# Altium schematic sheet Thermometers.SchDoc: =ProjectName
size 420 x 297 mm; Author: T.P.; CompanyName: WUT; DrawnBy: T.P.; Organization: WUT ISE; Address1: Warsaw Univeristy of Technology; Address2: Nowowiejska 15/19; DocumentNumber: 22; Revision: 0.9; SheetNumber: 22; SheetTotal: 36; EDA_Number: ARTIQ; Projet: ARTIQ/SINARA; ModifiedBy: -; CreateDate: XX/XX/XXXX; CheckedDate: -; Title2: Thermometers.SchDoc; DivGrp: ISE; Designer: G.K. and T.P.; ModifiedDate: -; ProjectName: ADC/DAC MEZZANINE
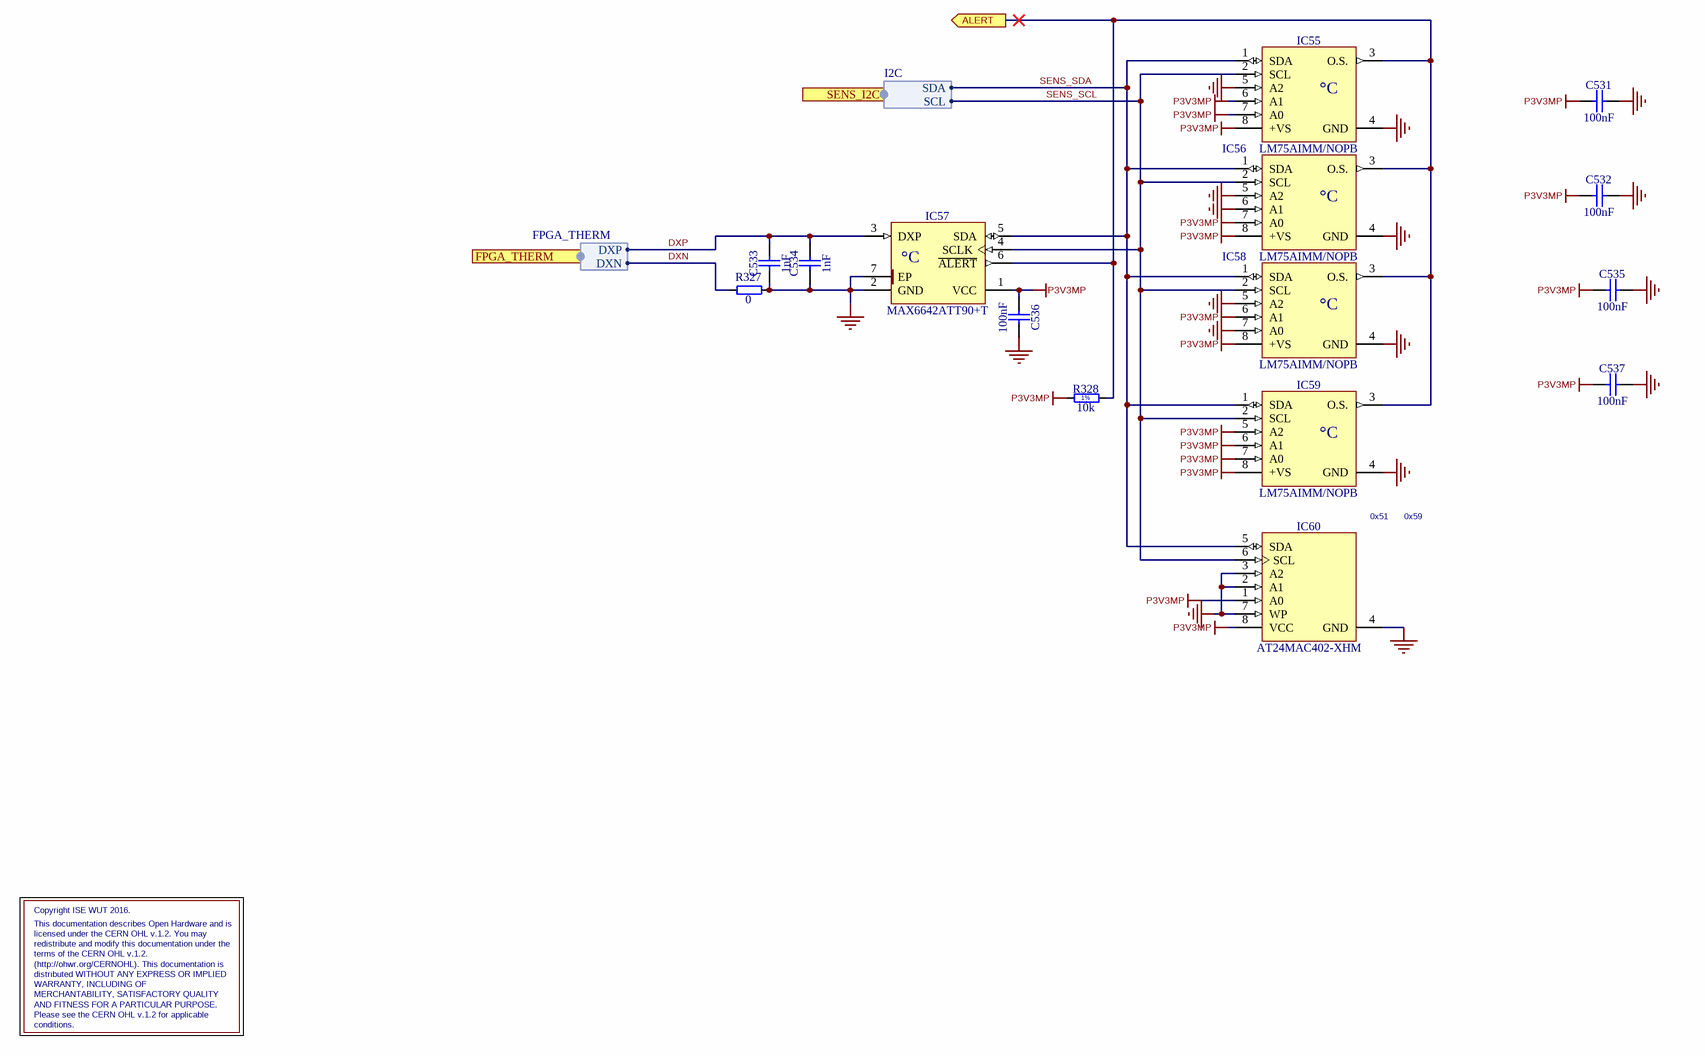
[diagram p0: Thermometers.SchDoc]

## Parts
C531  100nF  [CAPC0603X33N]
C532  100nF  [CAPC0603X33N]
C533  1nF  [CAPC1005X55N]
C534  1nF  [CAPC1005X55N]
C535  100nF  [CAPC0603X33N]
C536  100nF  [CAPC0603X33N]
C537  100nF  [CAPC0603X33N]
IC55  LM75AIMM/NOPB  [SOP65P490X109-8N]
IC56  LM75AIMM/NOPB  [SOP65P490X109-8N]
IC57  MAX6642ATT90+T  [SON95P300X300X80-7N-R160X240]
IC58  LM75AIMM/NOPB  [SOP65P490X109-8N]
IC59  LM75AIMM/NOPB  [SOP65P490X109-8N]
IC60  AT24MAC402-XHM  [SOP65P640X120-8N]
R327  0  [RESC1005X40N]
R328  10k  [RESC1005X40N]

## Ports
ALERT (out), FPGA_THERM (harness FPGA_THERM), SENS_I2C (harness I2C)

## Harnesses
FPGA_THERM: DXN, DXP
I2C: SCL, SDA

## Nets
GND: C531.2 C532.2 C533.1 C534.1 C535.2 C536.1 C537.2 IC55.4(GND) IC55.5(A2) IC56.4(GND) IC56.5(A2) IC56.6(A1) IC57.2(GND) IC57.7(EP) IC58.4(GND) IC58.5(A2) IC58.7(A0) IC59.4(GND) IC60.2(A1) IC60.3(A2) IC60.4(GND) IC60.7(WP) R327.2
P3V3MP: C531.1 C532.1 C535.1 C536.2 C537.1 IC55.6(A1) IC55.7(A0) IC55.8(+VS) IC56.7(A0) IC56.8(+VS) IC57.1(VCC) IC58.6(A1) IC58.8(+VS) IC59.5(A2) IC59.6(A1) IC59.7(A0) IC59.8(+VS) IC60.1(A0) IC60.8(VCC) R328.1
ALERT: IC55.3(O.S.) IC56.3(O.S.) IC57.6(~{ALERT}) IC58.3(O.S.) IC59.3(O.S.) R328.2 ; port ALERT
DXN: R327.1 ; port FPGA_THERM.DXN
DXP: C533.2 C534.2 IC57.3(DXP) ; port FPGA_THERM.DXP
SENS_SCL: IC55.2(SCL) IC56.2(SCL) IC57.4(SCLK) IC58.2(SCL) IC59.2(SCL) IC60.6(SCL) ; port SENS_I2C.SCL
SENS_SDA: IC55.1(SDA) IC56.1(SDA) IC57.5(SDA) IC58.1(SDA) IC59.1(SDA) IC60.5(SDA) ; port SENS_I2C.SDA

## Notes on the sheet
- 0x51
- 0x59
- Copyright ISE WUT 2016.
- licensed under the CERN OHL v.1.2. You may
- distributed WITHOUT ANY EXPRESS OR IMPLIED
- redistribute and modify this documentation under the
- (http://ohwr.org/CERNOHL). This documentation is
- This documentation describes Open Hardware and is
- terms of the CERN OHL v.1.2.
- WARRANTY, INCLUDING OF
- conditions.
- AND FITNESS FOR A PARTICULAR PURPOSE.
- Please see the CERN OHL v.1.2 for applicable
- MERCHANTABILITY, SATISFACTORY QUALITY
- Project/Equipment
- Document
- Designer
- Drawn by
- Check.by
- File
- Last Mod.
- Print Date
- Sheet
- Size
- A3
- of
- Rev
- (in symbol LM75AIMM/NOPB) °C
- (in symbol MAX6642ATT90+T) °C
- (in symbol R0402_10K_1%_0.0625W_100PPM) 1%

## Library data of the parts
C531 C532 C535-C537 = CC0201_100NF_6.3V_10%_X5R: Non-polarised capacitor; Manufacturer: GENERIC; Part Description: SMD Multilayer Chip Ceramic Capacitor; Manufacturer1 Part Number: 02016D104KAT2A; Tolerance: ±10%; Voltage: 6.3V; TC: X5R; Manufacturer Part Number: CC0201_100NF_6.3V_10%_X5R; Part Number: CC0201_100NF_6.3V_10%_X5R; Value: 100nF; Component Kind: Standard; Component Type: Standard; Pin Count: 2; Status: Not Recommended; Case: 0201; Mounted: Yes; Socket: No; SMD: Yes; Sense: No; Manufacturer1 Example: AVX; Manufacturer1 ComponentHeight: 0.33mm; HelpURL: \\cern.ch\dfs\Applications\Altium\Datasheets\CC0201_X5R_AVX.pdf; Author: CERN DEM JLC; CreateDate: 03.12.2007; LatestRevisionDate: 03.12.2007
C533 C534 = CC0402_1NF_50V_10%_X7R: Non-polarised capacitor; Manufacturer: GENERIC; Part Description: SMD Multilayer Chip Ceramic Capacitor; Manufacturer1 Part Number: 223858715623; Tolerance: ±10%; Voltage: 50V; TC: X7R; Manufacturer Part Number: CC0402_1NF_50V_10%_X7R; Part Number: CC0402_1NF_50V_10%_X7R; Value: 1nF; Component Kind: Standard; Component Type: Standard; Pin Count: 2; Status: Not Recommended; Case: 0402; Mounted: Yes; Socket: No; SMD: Yes; Sense: No; Manufacturer1 Example: PHYCOMP; Manufacturer1 ComponentHeight: 0.55mm; HelpURL: \\cern.ch\dfs\Applications\Altium\Datasheets\CC0402_X7R_PHYCOMP.pdf; Author: CERN DEM JLC; CreateDate: 03.12.2007; LatestRevisionDate: 03.12.2007
IC55 IC56 IC58 IC59 = LM75AIMM/NOPB: Digital Temperature Sensor and Thermal Watchdog with Two-Wire Interface; Manufacturer: TEXAS INSTRUMENTS; Part Description: -25° to +100°C ±2°C Digital Temperature Sensor and Thermal Watchdog with Two-Wire Interface; PressFit: No; Bonding: No; Manufacturer Part Number: LM75AIMM/NOPB; PackageDescription: SOP, 0.65mm pitch; 8 pin,3.00mm W X 3.00mm L X 1.09mm H bodyI, PC Medium Density; Part Number: LM75AIMM/NOPB; Component Kind: Standard; Component Type: Standard; Device: LM75AIMM/NOPB; Pin Count: 8; Case: SSOP8; Mounted: Yes; Socket: No; SMD: Yes; Sense: No; ComponentHeight: 1.09mm; HelpURL: \\cern.ch\dfs\Applications\Altium\Datasheets\LM75AIMM-NOPB.pdf; Author: CERN DEM JLC; CreateDate: 15.10.2012; LatestRevisionDate: 15.10.2012
IC57 = MAX6642ATT90+T: ±1°C, SMBus-Compatible Remote/Local Temperature Sensor with Overtemperature Alarm; Manufacturer: MAXIM; Part Description: 0°C to +125°C, ±1°C, SMBus-Compatible Remote/Local Temperature Sensor with Overtemperature Alarm (Address 1001 000); PressFit: No; Bonding: No; Manufacturer Part Number: MAX6642ATT90+T; PackageDescription: SON, 0.95mm Pitch; 6 Pin, 3.00mm W X 3mm L X 0.80mm H body (w/Thermal Tab 1.6mm x 2.4mm); Part Number: MAX6642ATT90+T; Component Kind: Standard; Component Type: Standard; Device: MAX6642ATT90+T; Pin Count: 7; Case: SON6; Mounted: Yes; Socket: No; SMD: Yes; Sense: No; ComponentHeight: 0.8mm; HelpURL: \\cern.ch\dfs\Applications\Altium\Datasheets\MAX6642ATT90+T.pdf; Author: CERN DEM JLC; CreateDate: 26.11.2013; LatestRevisionDate: 26.11.2013
IC60 = AT24MAC402-XHM: 1.7V to 5.5V, I2C-Compatible (2-wire) 2-Kbit (256 x 8) Serial EEPROM; Manufacturer: ATMEL; Part Description: 1.7V to 5.5V, I2C-Compatible (2-wire) 2-Kbit (256 x 8) Serial EEPROM with a EUI-48 Address; PressFit: No; Bonding: No; Footprint: SOP65X640X120-8N; Manufacturer Part Number: AT24MAC402-XHM; PackageDescription: SOP, 0.65mm pitch; 8 pin, 4.40mm W X 3.00mm L X 1.20mm H body, IPC Medium Density; Part Number: AT24MAC402-XHM; Component Kind: Standard; Component Type: Standard; Device: AT24MAC402-XHM; Pin Count: 8; Case: TSSOP8; Mounted: Yes; Socket: No; SMD: Yes; Sense: No; ComponentHeight: 1.2mm; HelpURL: \\cern.ch\dfs\Applications\Altium\Datasheets\AT24MAC402-XHM.pdf; Author: CERN DEM MR; CreateDate: 09.03.2016; LatestRevisionDate: 09.11.2016
R327 = R0402_0R_JUMPER: Resistor; Manufacturer: GENERIC; Part Description: 1A (0.05R Max DC Resistance) Zero Ohm Jumper; Manufacturer1 Part Number: 232270591001L; PressFit: No; Manufacturer Part Number: R0402_0R_JUMPER; Part Number: R0402_0R_JUMPER; Value: 0; Component Kind: Standard; Component Type: Standard; Pin Count: 2; Status: Not Recommended; Case: 0402; Mounted: Yes; Sense: No; Socket: No; SMD: Yes; Manufacturer1 Example: YAGEO PHYCOMP; Manufacturer1 ComponentHeight: 0.4mm; HelpURL: \\cern.ch\dfs\Applications\Altium\Datasheets\R0402_Phycomp_RC0402.pdf; Author: CERN DEM JLC; CreateDate: 03.12.2007; LatestRevisionDate: 17.10.2012
R328 = R0402_10K_1%_0.0625W_100PPM: Resistor - 1%; Manufacturer: GENERIC; Part Description: General Purpose Thick Film Chip Resistor; Manufacturer1 Part Number: 232270671003L; TC: ±100ppm/°C; PressFit: No; Manufacturer Part Number: R0402_10K_1%_0.0625W_100PPM; Part Number: R0402_10K_1%_0.0625W_100PPM; Tolerance: ±1%; Value: 10k; Component Kind: Standard; Component Type: Standard; Pin Count: 2; Status: Not Recommended; Power: 0.0625W; Case: 0402; Mounted: Yes; Sense: No; Socket: No; SMD: Yes; Manufacturer1 Example: YAGEO PHYCOMP; Manufacturer1 ComponentHeight: 0.4mm; HelpURL: \\cern.ch\dfs\Applications\Altium\Datasheets\R0402_Phycomp_RC0402.pdf; Author: CERN DEM JLC; CreateDate: 03.12.2007; LatestRevisionDate: 17.10.2012